# EAGLE design DressCode (EAGLE 6.4)
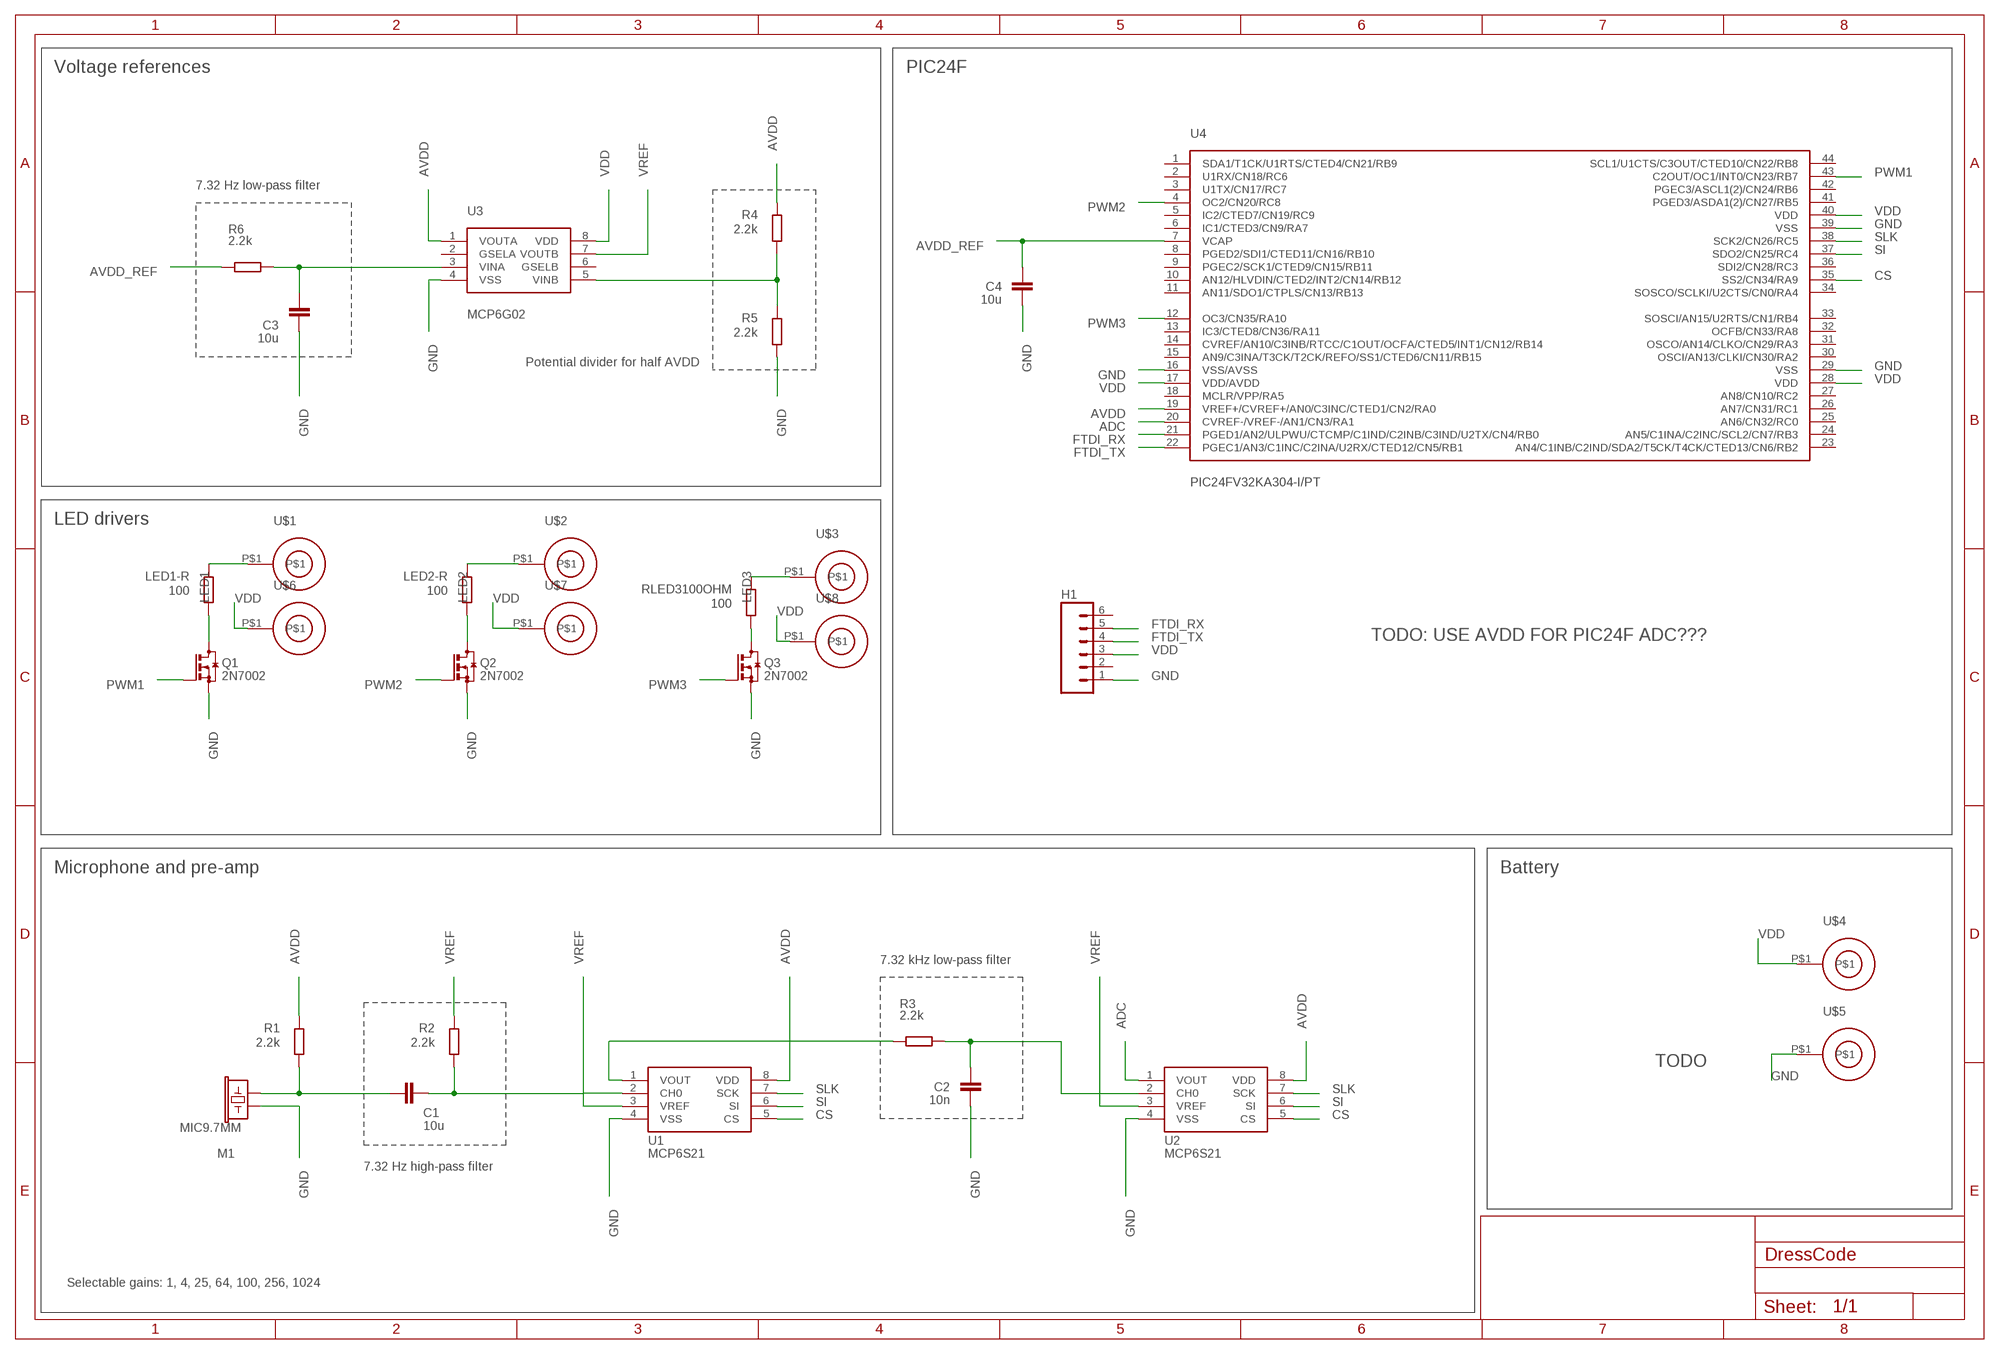
[diagram p0: schematic, sheet 1]

## Parts
C1  10u  C-EUC0805  [C0805]
C2  10n  C-EUC0805  [C0805]
C3  10u  C-EUC0805  [C0805]
C4  10u  C-EUC0805  [C0805]
H1  M06LOCK  [1X06_LOCK]
LED1-R  100  R-EU_R0805  [R0805]
LED2-R  100  R-EU_R0805  [R0805]
M1  MIC9.7MM  [MIC-9.7MM]
Q1  2N7002  BSS123  [SOT23]
Q2  2N7002  BSS123  [SOT23]
Q3  2N7002  BSS123  [SOT23]
R1  2.2k  R-EU_R0805  [R0805]
R2  2.2k  R-EU_R0805  [R0805]
R3  2.2k  R-EU_R0805  [R0805]
R4  2.2k  R-EU_R0805  [R0805]
R5  2.2k  R-EU_R0805  [R0805]
R6  2.2k  R-EU_R0805  [R0805]
RLED3100OHM  100  R-EU_R0805  [R0805]
U1  MCP6S21  [SOIC-8]
U2  MCP6S21  [SOIC-8]
U3  MCP6G02  [SOIC-8]
U4  PIC24FV32KA304-I/PT  [TQFP44]
U$1  SEWING-VIA  [SEWING-VIA2MM]
U$2  SEWING-VIA  [SEWING-VIA2MM]
U$3  SEWING-VIA  [SEWING-VIA2MM]
U$4  SEWING-VIA  [SEWING-VIA2MM]
U$5  SEWING-VIA  [SEWING-VIA2MM]
U$6  SEWING-VIA  [SEWING-VIA2MM]
U$7  SEWING-VIA  [SEWING-VIA2MM]
U$8  SEWING-VIA  [SEWING-VIA2MM]

## Nets
ADC: U2.1(VOUT) U4.20(CVREF-/VREF-/AN1/CN3/RA1)
AVDD: R1.2 R4.2 U1.8(VDD) U2.8(VDD) U3.1(VOUTA) U4.19(VREF+/CVREF+/AN0/C3INC/CTED1/CN2/RA0)
AVDD_REF: C4.2 R6.1 U4.7(VCAP)
CS: U1.5(CS) U2.5(CS) U4.35(SS2/CN34/RA9)
FTDI_RX: H1.5 U4.21(PGED1/AN2/ULPWU/CTCMP/C1IND/C2INB/C3IND/U2TX/CN4/RB0)
FTDI_TX: H1.4 U4.22(PGEC1/AN3/C1INC/C2INA/U2RX/CTED12/CN5/RB1)
GND: C2.2 C3.1 C4.1 H1.1 M1.2 Q1.2(S) Q2.2(S) Q3.2(S) R5.1 U1.4(VSS) U2.4(VSS) U3.4(VSS) U4.16(VSS/AVSS) U4.29(VSS) U4.39(VSS) U$5.P$1
LED1: LED1-R.2 U$1.P$1
LED2: LED2-R.2 U$2.P$1
LED3: RLED3100OHM.2 U$3.P$1
N$1: C1.1 M1.1 R1.1
N$2: C1.2 R2.1 U1.2(CH0)
N$3: C2.1 R3.2 U2.2(CH0)
N$4: R3.1 U1.1(VOUT)
N$5: C3.2 R6.2 U3.3(VINA)
N$6: R4.1 R5.2 U3.5(VINB)
N$8: LED1-R.1 Q1.3(D)
N$9: LED2-R.1 Q2.3(D)
N$11: Q3.3(D) RLED3100OHM.1
PWM1: Q1.1(G) U4.43(C2OUT/OC1/INT0/CN23/RB7)
PWM2: Q2.1(G) U4.4(OC2/CN20/RC8)
PWM3: Q3.1(G) U4.12(OC3/CN35/RA10)
SI: U1.6(SI) U2.6(SI) U4.37(SDO2/CN25/RC4)
SLK: U1.7(SCK) U2.7(SCK) U4.38(SCK2/CN26/RC5)
VDD: H1.3 U3.8(VDD) U4.17(VDD/AVDD) U4.28(VDD) U4.40(VDD) U$4.P$1 U$6.P$1 U$7.P$1 U$8.P$1
VREF: R2.2 U1.3(VREF) U2.3(VREF) U3.7(VOUTB)
Unconnected: H1.2 H1.6 U3.2(GSELA) U3.6(GSELB) U4.1(SDA1/T1CK/U1RTS/CTED4/CN21/RB9) U4.2(U1RX/CN18/RC6) U4.3(U1TX/CN17/RC7) U4.5(IC2/CTED7/CN19/RC9) U4.6(IC1/CTED3/CN9/RA7) U4.8(PGED2/SDI1/CTED11/CN16/RB10) U4.9(PGEC2/SCK1/CTED9/CN15/RB11) U4.10(AN12/HLVDIN/CTED2/INT2/CN14/RB12) U4.11(AN11/SDO1/CTPLS/CN13/RB13) U4.13(IC3/CTED8/CN36/RA11) U4.14(CVREF/AN10/C3INB/RTCC/C1OUT/OCFA/CTED5/INT1/CN12/RB14) U4.15(AN9/C3INA/T3CK/T2CK/REFO/SS1/CTED6/CN11/RB15) U4.18(MCLR/VPP/RA5) U4.23(AN4/C1INB/C2IND/SDA2/T5CK/T4CK/CTED13/CN6/RB2) U4.24(AN5/C1INA/C2INC/SCL2/CN7/RB3) U4.25(AN6/CN32/RC0) U4.26(AN7/CN31/RC1) U4.27(AN8/CN10/RC2) U4.30(OSCI/AN13/CLKI/CN30/RA2) U4.31(OSCO/AN14/CLKO/CN29/RA3) U4.32(OCFB/CN33/RA8) U4.33(SOSCI/AN15/U2RTS/CN1/RB4) U4.34(SOSCO/SCLKI/U2CTS/CN0/RA4) U4.36(SDI2/CN28/RC3) U4.41(PGED3/ASDA1(2)/CN27/RB5) U4.42(PGEC3/ASCL1(2)/CN24/RB6) U4.44(SCL1/U1CTS/C3OUT/CTED10/CN22/RB8)

## Notes on the sheet
- Voltage references | PIC24F
- 7.32 Hz low-pass filter
- Potential divider for half AVDD
- LED drivers
- TODO: USE AVDD FOR PIC24F ADC???
- Microphone and pre-amp | Battery
- 7.32 kHz low-pass filter
- TODO
- 7.32 Hz high-pass filter
- Selectable gains: 1, 4, 25, 64, 100, 256, 1024

## Library data of the parts
C1-C4 = rcl:C-EU: CAPACITOR, European symbol
H1 = SparkFun:M06: Header 6 Standard 6-pin 0.1" header. Use with straight break away headers (SKU : PRT-00116), right angle break away headers (PRT-00553), swiss pins (PRT-00743), machine pins (PRT-00117), and female headers (PRT-00115). Molex polarized connector foot print use with SKU : PRT-08094 with associated crimp pins and housings. NOTES ON THE VARIANTS LOCK and LOCK_LONGPADS... This footprint was designed to help hold the alignment of a through-hole component (i.e. 6-pin header) while soldering it into place. You may notice that each hole has been shifted either up or down by 0.005 of an inch from it's more standard position (which is a perfectly straight line). This slight alteration caused the pins (the squares in the middle) to touch the edges of the holes. Because they are alternating, it causes a "brace" to hold the component in place. 0.005 has proven to be the perfect amount of "off-center" position when using our standard breakaway headers. Although looks a little odd when you look at the bare footprint, once you have a header in there, the alteration is very hard to notice. Also, if you push a header all the way into place, it is covered up entirely on the bottom side. This idea of altering the position of holes to aid alignment will be further integrated into the Sparkfun Library for other footprints. It can help hold any component with 3 or more connection pins.
LED1-R LED2-R R1-R6 RLED3100OHM = rcl:R-EU_: RESISTOR, European symbol
M1 = SparkFun:MIC: Microphone Omni-directional electret microphone. 9.7mm standard diameter.
Q1-Q3 = transistor-small-signal:BSS123: N-CHANNEL MOS FET
U1 U2 = x-io:MCP6S21
U3 = x-io:MCP6G02
U4 = x-io:PIC24FV32KA304
U$1-U$8 = hannah:SEWING-VIA

## Board
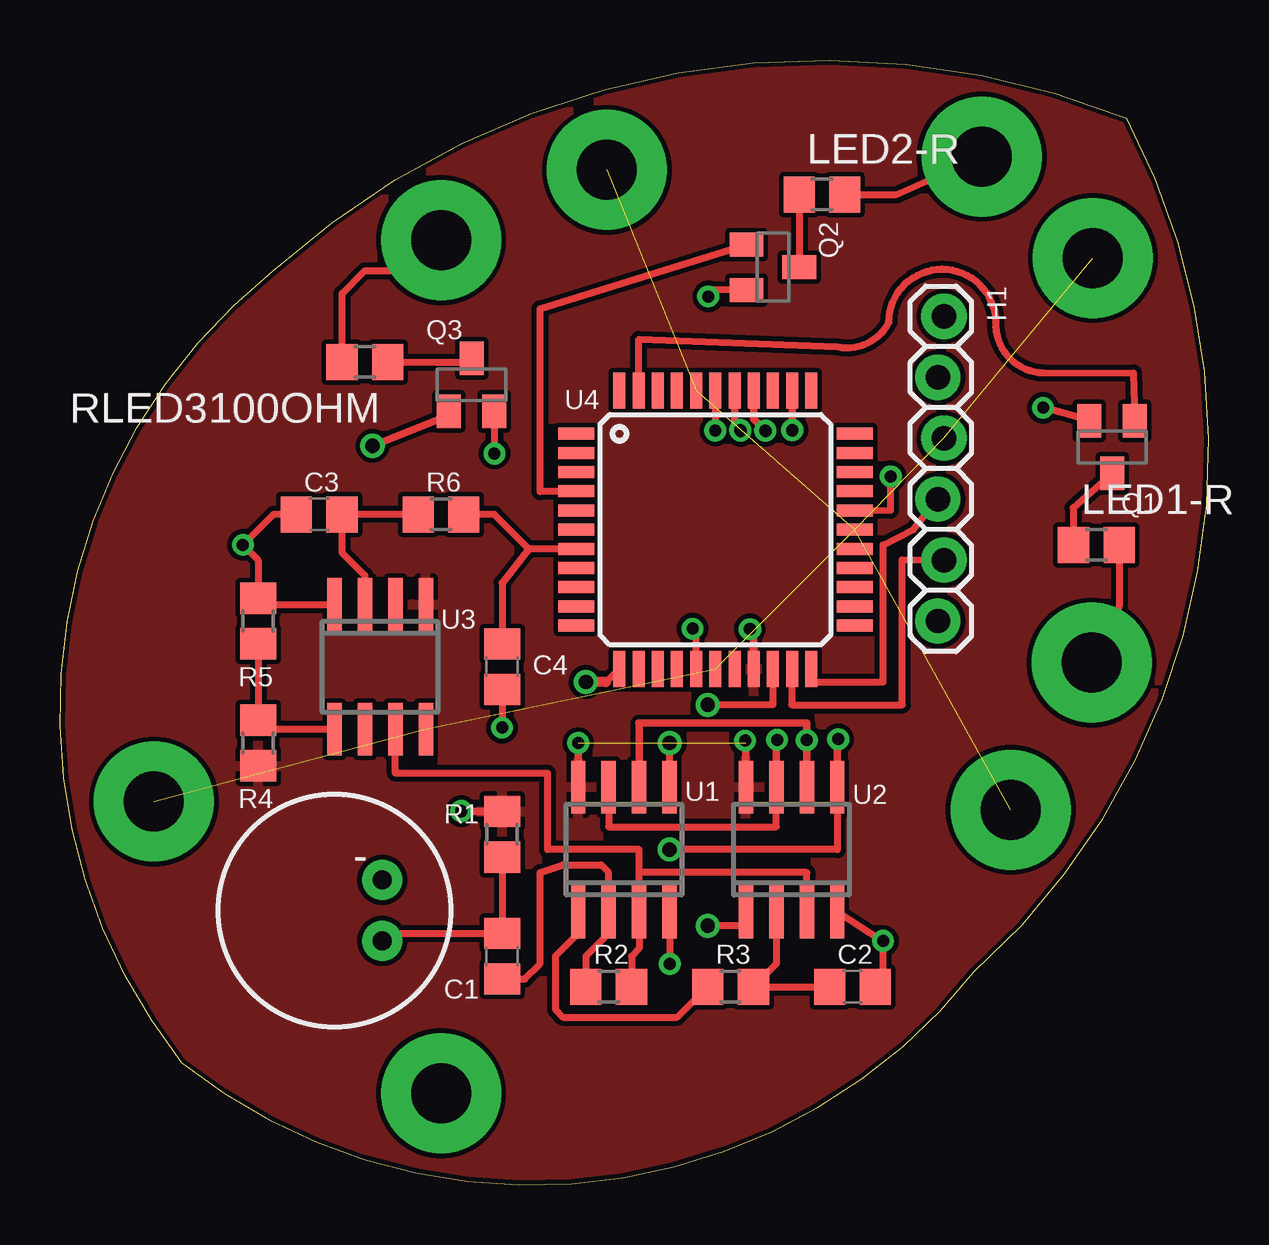
[diagram p1: board, top side]
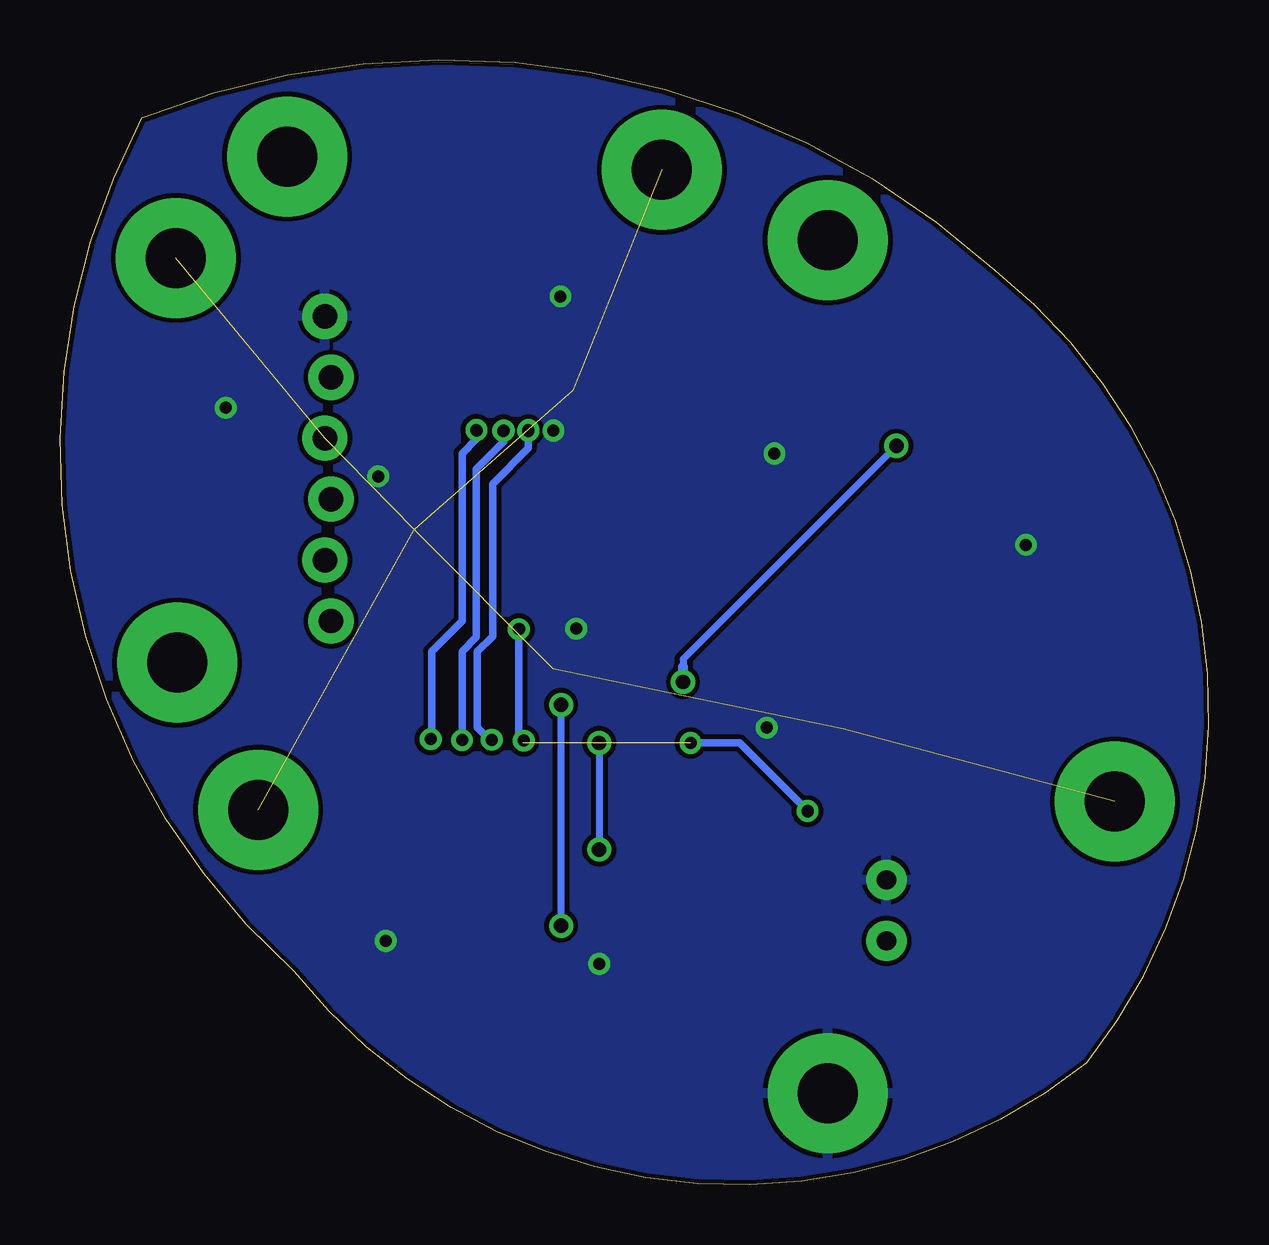
[diagram p2: board, bottom side, seen from below]

Size 47.87 x 46.88 mm. Coordinates in mm from the lower left corner, seen from the top.
Outline: 5.08,5.08 arc-90 8.89,38.1 arc-64 44.45,44.45 arc-76 38.1,8.89 arc-90 5.08,5.08
Copper layers (1*16): Top 0.035mm / dielectric 1.5mm / Bottom 0.035mm
Design rules "default *": minimum track width 0.2mm, minimum drill 0.5mm, track to track 0.2mm, track to pad 0.2mm, pad to pad 0.2mm, via to via 0.2mm, smd to smd 0.2mm, copper to edge 0.2mm, drill to drill 0.3mm, minimum pad ring 10mil, minimum via ring 8mil, stop-mask expansion 4mil, vias tented up to drill 1mm, thermal gap 0.2mm

### Footprints (pad centres in the part's own frame; a part is rotated, then mirrored left to right if it is on the bottom)
C0805 = smd 1.3 x 1.5: 1 -0.95,0; 2 0.95,0
1X06_LOCK = drill 1.016 pad 1.88: 1 0,0; 2 2.54,-0.254; 3 5.08,0; 4 7.62,-0.254; 5 10.16,0; 6 12.7,-0.254
R0805 = smd 1.3 x 1.5: 1 -0.95,0; 2 0.95,0
MIC-9.7MM = drill 0.8 pad 1.676: 1 -2,1.27; 2 -2,-1.27
SOT23 = smd 1 x 1.4: 1 -0.95,-1.1; 2 0.95,-1.1; 3 0,1.1
SOIC-8 = smd 0.6 x 2.2: 1 -1.905,-2.6; 2 -0.635,-2.6; 3 0.635,-2.6; 4 1.905,-2.6; 5 1.905,2.6; 6 0.635,2.6; 7 -0.635,2.6; 8 -1.905,2.6
TQFP44 = smd 1.5 x 0.5: 1 -5.8,4; 2 -5.8,3.2; 3 -5.8,2.4; 4 -5.8,1.6; 5 -5.8,0.8; 6 -5.8,0; 7 -5.8,-0.8; 8 -5.8,-1.6; 9 -5.8,-2.4; 10 -5.8,-3.2; 11 -5.8,-4; 23 5.8,-4; 24 5.8,-3.2; 25 5.8,-2.4; 26 5.8,-1.6; 27 5.8,-0.8; 28 5.8,0; 29 5.8,0.8; 30 5.8,1.6; 31 5.8,2.4; 32 5.8,3.2; 33 5.8,4 | smd 0.5 x 1.5: 12 -4,-5.8; 13 -3.2,-5.8; 14 -2.4,-5.8; 15 -1.6,-5.8; 16 -0.8,-5.8; 17 0,-5.8; 18 0.8,-5.8; 19 1.6,-5.8; 20 2.4,-5.8; 21 3.2,-5.8; 22 4,-5.8; 34 4,5.8; 35 3.2,5.8; 36 2.4,5.8; 37 1.6,5.8; 38 0.8,5.8; 39 0,5.8; 40 -0.8,5.8; 41 -1.6,5.8; 42 -2.4,5.8; 43 -3.2,5.8; 44 -4,5.8
SEWING-VIA2MM = drill 2.5 pad 5: P$1 0,0

### Placement (x,y rotation side)
C1  18.42,9.53 270 top
C2  33.02,8.26 0 top
C3  10.8,27.94 0 top
C4  18.42,21.59 90 top
H1  36.83,36.2 270 top
LED1-R  43.18,26.67 0 top
LED2-R  31.75,41.28 0 top
M1  11.43,11.43 180 top
Q1  43.84,30.75 180 top
Q2  29.7,38.25 270 top
Q3  17.15,33.34 0 top
R1  18.42,14.61 90 top
R2  22.86,8.26 0 top
R3  27.94,8.26 0 top
R4  8.26,18.42 270 top
R5  8.26,23.5 270 top
R6  15.88,27.94 180 top
RLED3100OHM  12.7,34.29 180 top
U1  23.5,13.97 0 top
U2  30.48,13.97 0 top
U3  13.34,21.59 180 top
U4  27.31,27.31 0 top
U$1  42.99,21.76 0 top
U$2  38.41,42.86 0 top
U$3  15.88,39.37 0 top
U$4  3.91,15.97 0 top
U$5  15.88,3.81 0 top
U$6  39.62,15.63 0 top
U$7  43.04,38.63 0 top
U$8  22.79,42.3 0 top
U$9  [DRESSCODE-LOGO-SM]  9.53,11.43 0 top

### Tracks (layer width: path | path; a pad name or v marks a point on that pad's centre or on a via)
ADC  (via drill 0.6)
  Top 0.3: U4.20 29.71,20 v26.99,20 | U2.1 28.58,10.8 v26.99,10.8
  Bottom 0.3: v26.99,10.8 v26.99,20
AVDD  (via drill 0.5)  (3 unrouted)
  Top 0.305: U2.8 28.58,18.42 | U4.19 28.91,23.01 v28.76,23.16 | U1.8 21.59,18.42 | R1.2 16.75,15.56 v16.72,15.58
  Bottom 0.305: v28.76,23.16 28.76,18.6 28.58,18.42 | v16.72,15.58 19.55,18.42 21.59,18.42
  pour Top: -0.63,-0.63 50.17,-0.63 49.53,49.53 -1.27,49.53
AVDD_REF
  Top 0.3: U4.7 19.53,26.51 | 19.53,26.51 18.1,27.94 R6.1 | 19.53,26.51 18.42,25.08 C4.2
CS  (via drill 0.5, 0.6)  (1 unrouted)
  Top 0.3: U2.5 32.39,13.97 v25.4,13.97 | U1.5 v25.4,18.42
  Top 0.305: U4.35 v30.51,31.47 v30.51,31.46 | U2.5 32.39,18.42
  Bottom 0.3: v25.4,18.42 v25.4,13.97
  Bottom 0.305: v30.51,31.46 30.51,31.08 31.12,30.48 31.12,23.5 32.39,22.23 32.39,18.42
FTDI_RX
  Top 0.3: U4.21 30.48,21.51 30.48,20 35.1,20 35.09,26.05 H1.5
FTDI_TX
  Top 0.3: U4.22 31.43,20.96 34.29,20.96 34.29,26.67 35.56,27.31 H1.4
GND  (via drill 0.5)
  Top 0.3: C2.2 34.29,8.26 v34.29,10.16 34.23,10.16 U2.4 | U1.4 v25.4,9.21 | U4.16 26.51,23.03 v26.35,23.18 | U4.39 v27.31,31.43 | U4.29 34.61,28.12 v34.61,29.53 | C3.1 8.89,27.94 v7.62,26.67 8.26,26.04 R5.1 8.51,24.19 U3.4 | Q3.2 18.1,31.6 v18.1,30.48 | Q2.2 26.99,37.32 v27.02,37.03 | Q1.2 41.59,32.22 v40.96,32.39 | C4.1 v18.42,19.05
  pour Bottom: 0,-0.63 50.8,-0.63 49.53,49.53 -1.27,49.53
LED1
  Top 0.3: LED1-R.2 44.13,24.13 U$1.P$1
LED2
  Top 0.3: U$2.P$1 34.8,41.26 32.72,41.26 LED2-R.2
LED3
  Top 0.3: RLED3100OHM.2 11.75,37.15 12.7,38.1 14.61,38.1 U$3.P$1
N$1
  Top 0.3: R1.1 C1.1 13.75,10.48 M1.1
N$2
  Top 0.3: R2.1 21.91,9.53 22.86,10.48 U1.2 22.86,13.02 22.54,13.34 20.96,13.34 20,13.02 20,9.21 19.37,8.58 C1.2
N$3
  Top 0.3: U2.2 29.85,9.21 R3.2 C2.1
N$4
  Top 0.3: U1.1 21.59,10.48 20.64,9.53 20.64,7.3 20.96,6.99 25.72,6.99 R3.1
N$5
  Top 0.3: R6.2 C3.2 11.75,26.35 12.7,25.4 U3.3
N$6
  Top 0.3: R5.2 R4.1 8.63,18.99 U3.5
N$8
  Top 0.3: Q1.3 42.21,28.21 LED1-R.1
N$9
  Top 0.3: LED2-R.1 30.8,41.1 Q2.3
N$10  (via drill 0.5)
  other vias: 28.36,31.42
N$11
  Top 0.3: RLED3100OHM.1 17,34.29 Q3.3
N$12  (via drill 0.5)
  other vias: 29.4,31.42
N$13  (via drill 0.5)
  other vias: 30.51,31.44
N$14  (via drill 0.5)
  other vias: 28.55,18.51
N$15  (via drill 0.5)
  other vias: 29.88,18.55
N$16  (via drill 0.5)
  other vias: 32.42,18.57
N$17  (via drill 0.5)
  other vias: 31.12,18.53
N$18  (via drill 0.5)
  other vias: 28.74,23.16
N$19  (via drill 0.5)
  other vias: 21.59,18.42
N$20  (via drill 0.5)
  other vias: 16.72,15.57
PWM1
  Top 0.3: U4.43 24.11,35.22 24.13,35.24 32.39,34.93 arc74 34.54,35.94 arc-180 38.98,35.94 arc90 40.97,33.84 44.72,33.84 Q1.1
PWM2
  Top 0.3: U4.4 21.49,28.89 20,28.89 20.01,36.52 Q2.1
PWM3  (via drill 0.6)
  Top 0.3: Q3.1 16.19,32.07 v13.02,30.8 | U4.12 22.76,20.96
  Top 0.406: 22.76,20.96 v21.91,20.96
  Bottom 0.3: v13.02,30.8 21.91,21.91 21.91,21.59
  Bottom 0.406: v21.91,20.96 21.91,21.59
SI  (via drill 0.5)  (1 unrouted)
  Top 0.305: U4.37 28.91,31.92 v29.38,31.44 | U1.6 24.13,19.23 24.12,19.25 31.11,19.25 31.11,18.42 31.12,18.42 U2.6
  Bottom 0.305: v29.38,31.44 29.38,30.97 30.52,29.84 30.52,22.83 31.12,22.23 31.12,18.42
SLK  (via drill 0.5)  (1 unrouted)
  Top 0.3: U1.7 22.86,14.92 29.85,14.92 U2.7
  Top 0.305: U2.7 29.85,18.42 | U4.38 28.11,31.7 v28.35,31.45
  Bottom 0.305: v28.35,31.45 28.35,30.71 29.85,29.21 29.85,22.86 30.48,22.23 30.48,19.05 29.85,18.42
VDD  (8 unrouted)
VREF
  Top 0.3: R2.2 23.81,9.53 24.13,9.84 U1.3 24.13,13.02 | U2.3 31.12,13.02 24.13,13.02 | 24.13,13.02 24.13,13.97 20.32,13.97 20.32,17.15 13.97,17.15 U3.7